# EAGLE schematic time-circuits (EAGLE 9.1.0)
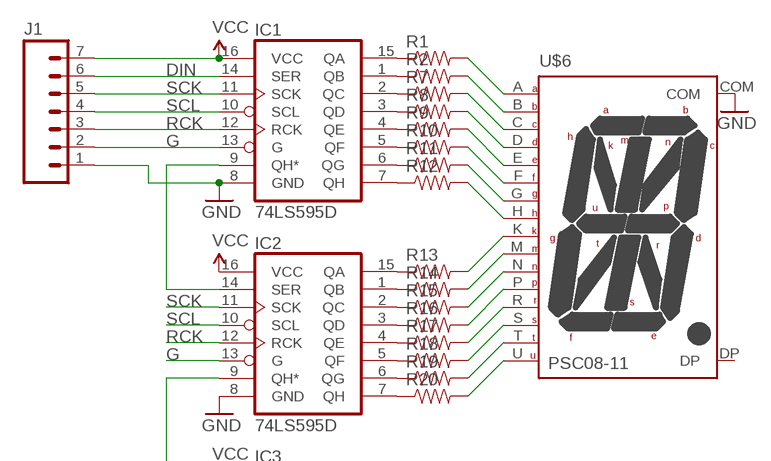
[diagram p0: schematic, sheet 1, part 1 of 2]
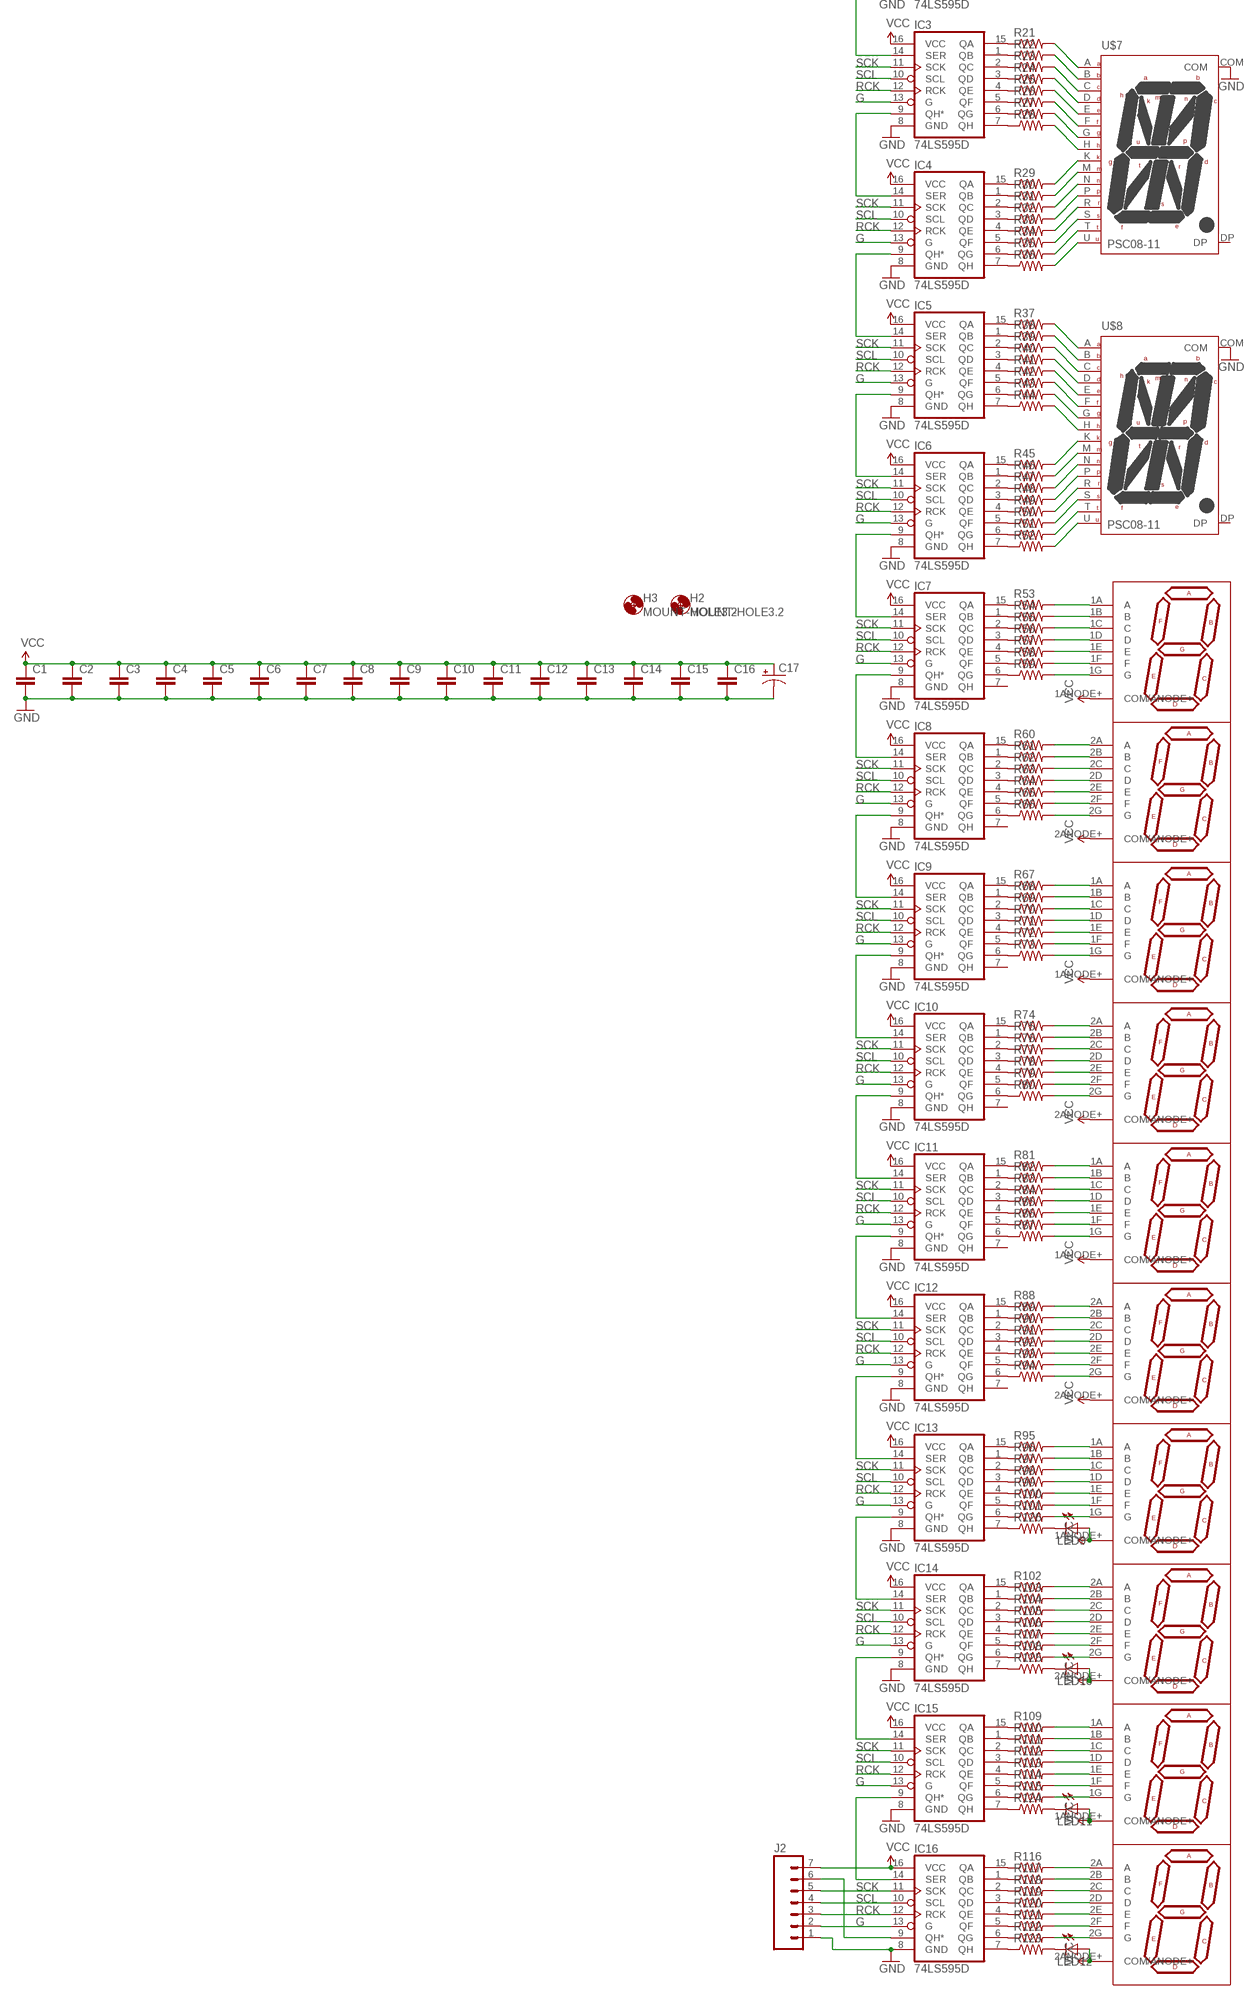
[diagram p1: schematic, sheet 1, part 2 of 2]

## Parts
C1  CAP0805  [0805]
C2  CAP0805  [0805]
C3  CAP0805  [0805]
C4  CAP0805  [0805]
C5  CAP0805  [0805]
C6  CAP0805  [0805]
C7  CAP0805  [0805]
C8  CAP0805  [0805]
C9  CAP0805  [0805]
C10  CAP0805  [0805]
C11  CAP0805  [0805]
C12  CAP0805  [0805]
C13  CAP0805  [0805]
C14  CAP0805  [0805]
C15  CAP0805  [0805]
C16  CAP0805  [0805]
C17  CAP_POLH13  [PANASONIC_H13]
H2  MOUNT-HOLE3.2  [3,2]
H3  MOUNT-HOLE3.2  [3,2]
IC1  74LS595D  [SO16]
IC2  74LS595D  [SO16]
IC3  74LS595D  [SO16]
IC4  74LS595D  [SO16]
IC5  74LS595D  [SO16]
IC6  74LS595D  [SO16]
IC7  74LS595D  [SO16]
IC8  74LS595D  [SO16]
IC9  74LS595D  [SO16]
IC10  74LS595D  [SO16]
IC11  74LS595D  [SO16]
IC12  74LS595D  [SO16]
IC13  74LS595D  [SO16]
IC14  74LS595D  [SO16]
IC15  74LS595D  [SO16]
IC16  74LS595D  [SO16]
J1  M07LOCK  [1X07_LOCK]
J2  M07LOCK  [1X07_LOCK]
LED9  LED5MM  [LED5MM]
LED10  LED5MM  [LED5MM]
LED11  LED5MM  [LED5MM]
LED12  LED5MM  [LED5MM]
R1  RESISTOR0805-RES  [0805]
R2  RESISTOR0805-RES  [0805]
R7  RESISTOR0805-RES  [0805]
R8  RESISTOR0805-RES  [0805]
R9  RESISTOR0805-RES  [0805]
R10  RESISTOR0805-RES  [0805]
R11  RESISTOR0805-RES  [0805]
R12  RESISTOR0805-RES  [0805]
R13  RESISTOR0805-RES  [0805]
R14  RESISTOR0805-RES  [0805]
R15  RESISTOR0805-RES  [0805]
R16  RESISTOR0805-RES  [0805]
R17  RESISTOR0805-RES  [0805]
R18  RESISTOR0805-RES  [0805]
R19  RESISTOR0805-RES  [0805]
R20  RESISTOR0805-RES  [0805]
R21  RESISTOR0805-RES  [0805]
R22  RESISTOR0805-RES  [0805]
R23  RESISTOR0805-RES  [0805]
R24  RESISTOR0805-RES  [0805]
R25  RESISTOR0805-RES  [0805]
R26  RESISTOR0805-RES  [0805]
R27  RESISTOR0805-RES  [0805]
R28  RESISTOR0805-RES  [0805]
R29  RESISTOR0805-RES  [0805]
R30  RESISTOR0805-RES  [0805]
R31  RESISTOR0805-RES  [0805]
R32  RESISTOR0805-RES  [0805]
R33  RESISTOR0805-RES  [0805]
R34  RESISTOR0805-RES  [0805]
R35  RESISTOR0805-RES  [0805]
R36  RESISTOR0805-RES  [0805]
R37  RESISTOR0805-RES  [0805]
R38  RESISTOR0805-RES  [0805]
R39  RESISTOR0805-RES  [0805]
R40  RESISTOR0805-RES  [0805]
R41  RESISTOR0805-RES  [0805]
R42  RESISTOR0805-RES  [0805]
R43  RESISTOR0805-RES  [0805]
R44  RESISTOR0805-RES  [0805]
R45  RESISTOR0805-RES  [0805]
R46  RESISTOR0805-RES  [0805]
R47  RESISTOR0805-RES  [0805]
R48  RESISTOR0805-RES  [0805]
R49  RESISTOR0805-RES  [0805]
R50  RESISTOR0805-RES  [0805]
R51  RESISTOR0805-RES  [0805]
R52  RESISTOR0805-RES  [0805]
R53  RESISTOR0805-RES  [0805]
R54  RESISTOR0805-RES  [0805]
R55  RESISTOR0805-RES  [0805]
R56  RESISTOR0805-RES  [0805]
R57  RESISTOR0805-RES  [0805]
R58  RESISTOR0805-RES  [0805]
R59  RESISTOR0805-RES  [0805]
R60  RESISTOR0805-RES  [0805]
R61  RESISTOR0805-RES  [0805]
R62  RESISTOR0805-RES  [0805]
R63  RESISTOR0805-RES  [0805]
R64  RESISTOR0805-RES  [0805]
R65  RESISTOR0805-RES  [0805]
R66  RESISTOR0805-RES  [0805]
R67  RESISTOR0805-RES  [0805]
R68  RESISTOR0805-RES  [0805]
R69  RESISTOR0805-RES  [0805]
R70  RESISTOR0805-RES  [0805]
R71  RESISTOR0805-RES  [0805]
R72  RESISTOR0805-RES  [0805]
R73  RESISTOR0805-RES  [0805]
R74  RESISTOR0805-RES  [0805]
R75  RESISTOR0805-RES  [0805]
R76  RESISTOR0805-RES  [0805]
R77  RESISTOR0805-RES  [0805]
R78  RESISTOR0805-RES  [0805]
R79  RESISTOR0805-RES  [0805]
R80  RESISTOR0805-RES  [0805]
R81  RESISTOR0805-RES  [0805]
R82  RESISTOR0805-RES  [0805]
R83  RESISTOR0805-RES  [0805]
R84  RESISTOR0805-RES  [0805]
R85  RESISTOR0805-RES  [0805]
R86  RESISTOR0805-RES  [0805]
R87  RESISTOR0805-RES  [0805]
R88  RESISTOR0805-RES  [0805]
R89  RESISTOR0805-RES  [0805]
R90  RESISTOR0805-RES  [0805]
R91  RESISTOR0805-RES  [0805]
R92  RESISTOR0805-RES  [0805]
R93  RESISTOR0805-RES  [0805]
R94  RESISTOR0805-RES  [0805]
R95  RESISTOR0805-RES  [0805]
R96  RESISTOR0805-RES  [0805]
R97  RESISTOR0805-RES  [0805]
R98  RESISTOR0805-RES  [0805]
R99  RESISTOR0805-RES  [0805]
R100  RESISTOR0805-RES  [0805]
R101  RESISTOR0805-RES  [0805]
R102  RESISTOR0805-RES  [0805]
R103  RESISTOR0805-RES  [0805]
R104  RESISTOR0805-RES  [0805]
R105  RESISTOR0805-RES  [0805]
R106  RESISTOR0805-RES  [0805]
R107  RESISTOR0805-RES  [0805]
R108  RESISTOR0805-RES  [0805]
R109  RESISTOR0805-RES  [0805]
R110  RESISTOR0805-RES  [0805]
R111  RESISTOR0805-RES  [0805]
R112  RESISTOR0805-RES  [0805]
R113  RESISTOR0805-RES  [0805]
R114  RESISTOR0805-RES  [0805]
R115  RESISTOR0805-RES  [0805]
R116  RESISTOR0805-RES  [0805]
R117  RESISTOR0805-RES  [0805]
R118  RESISTOR0805-RES  [0805]
R119  RESISTOR0805-RES  [0805]
R120  RESISTOR0805-RES  [0805]
R121  RESISTOR0805-RES  [0805]
R122  RESISTOR0805-RES  [0805]
R123  RESISTOR0805-RES  [0805]
R124  RESISTOR0805-RES  [0805]
R125  RESISTOR0805-RES  [0805]
R126  RESISTOR0805-RES  [0805]
U$1  DA08-11  [DA08-11]
U$2  DA08-11  [DA08-11]
U$3  DA08-11  [DA08-11]
U$4  DA08-11  [DA08-11]
U$5  DA08-11  [DA08-11]
U$6  PSC08-11  [PSC08-11]
U$7  PSC08-11  [PSC08-11]
U$8  PSC08-11  [PSC08-11]

## Nets
DIN: IC1.14(SER) J1.6
G: IC1.13(G) IC2.13(G) IC3.13(G) IC4.13(G) IC5.13(G) IC6.13(G) IC7.13(G) IC8.13(G) IC9.13(G) IC10.13(G) IC11.13(G) IC12.13(G) IC13.13(G) IC14.13(G) IC15.13(G) IC16.13(G) J1.2 J2.2
GND: C1.2 C2.2 C3.2 C4.2 C5.2 C6.2 C7.2 C8.2 C9.2 C10.2 C11.2 C12.2 C13.2 C14.2 C15.2 C16.2 C17.- IC1.8(GND) IC2.8(GND) IC3.8(GND) IC4.8(GND) IC5.8(GND) IC6.8(GND) IC7.8(GND) IC8.8(GND) IC9.8(GND) IC10.8(GND) IC11.8(GND) IC12.8(GND) IC13.8(GND) IC14.8(GND) IC15.8(GND) IC16.8(GND) J1.1 J2.1 U$6.COM U$7.COM U$8.COM
N$1: IC5.9(QH*) IC6.14(SER)
N$2: IC1.9(QH*) IC2.14(SER)
N$3: IC1.15(QA) R1.1
N$4: IC1.1(QB) R2.1
N$5: IC1.2(QC) R7.1
N$6: IC1.3(QD) R8.1
N$7: IC1.4(QE) R9.1
N$8: IC1.5(QF) R10.1
N$9: IC1.6(QG) R11.1
N$10: IC1.7(QH) R12.1
N$11: IC2.15(QA) R13.1
N$12: IC2.1(QB) R14.1
N$13: IC2.2(QC) R15.1
N$14: R53.2 U$1.1A(DIG1:A)
N$15: IC16.9(QH*) J2.6
N$16: R54.2 U$1.1B(DIG1:B)
N$17: R55.2 U$1.1C(DIG1:C)
N$18: IC2.3(QD) R16.1
N$19: IC2.4(QE) R17.1
N$20: R56.2 U$1.1D(DIG1:D)
N$21: R57.2 U$1.1E(DIG1:E)
N$22: R58.2 U$1.1F(DIG1:F)
N$23: R59.2 U$1.1G(DIG1:G)
N$24: R60.2 U$1.2A(DIG2:A)
N$25: R61.2 U$1.2B(DIG2:B)
N$26: R62.2 U$1.2C(DIG2:C)
N$27: IC2.5(QF) R18.1
N$28: IC2.6(QG) R19.1
N$29: IC2.7(QH) R20.1
N$30: R1.2 U$6.A
N$31: R2.2 U$6.B
N$32: R7.2 U$6.C
N$33: R8.2 U$6.D
N$34: R9.2 U$6.E
N$35: R10.2 U$6.F
N$36: R11.2 U$6.G
N$37: R12.2 U$6.H
N$38: R13.2 U$6.K
N$39: R14.2 U$6.M
N$40: R15.2 U$6.N
N$41: R16.2 U$6.P
N$42: R17.2 U$6.R
N$43: R18.2 U$6.S
N$44: R19.2 U$6.T
N$45: R20.2 U$6.U
N$46: IC3.9(QH*) IC4.14(SER)
N$47: IC3.15(QA) R21.1
N$48: IC3.1(QB) R22.1
N$49: IC3.2(QC) R23.1
N$50: IC3.3(QD) R24.1
N$51: IC3.4(QE) R25.1
N$52: IC3.5(QF) R26.1
N$53: IC3.6(QG) R27.1
N$54: IC3.7(QH) R28.1
N$55: IC4.15(QA) R29.1
N$56: IC4.1(QB) R30.1
N$57: IC4.2(QC) R31.1
N$58: IC4.3(QD) R32.1
N$59: IC4.4(QE) R33.1
N$60: IC4.5(QF) R34.1
N$61: IC4.6(QG) R35.1
N$62: IC4.7(QH) R36.1
N$63: R21.2 U$7.A
N$64: R22.2 U$7.B
N$65: R23.2 U$7.C
N$66: R24.2 U$7.D
N$67: R25.2 U$7.E
N$68: R26.2 U$7.F
N$69: R27.2 U$7.G
N$70: R28.2 U$7.H
N$71: R29.2 U$7.K
N$72: R30.2 U$7.M
N$73: R31.2 U$7.N
N$74: R32.2 U$7.P
N$75: R33.2 U$7.R
N$76: R34.2 U$7.S
N$77: R35.2 U$7.T
N$78: R36.2 U$7.U
N$79: IC5.15(QA) R37.1
N$80: IC5.1(QB) R38.1
N$81: IC5.2(QC) R39.1
N$82: IC5.3(QD) R40.1
N$83: IC5.4(QE) R41.1
N$84: IC5.5(QF) R42.1
N$85: IC5.6(QG) R43.1
N$86: IC5.7(QH) R44.1
N$87: IC6.15(QA) R45.1
N$88: IC6.1(QB) R46.1
N$89: IC6.2(QC) R47.1
N$90: IC6.3(QD) R48.1
N$91: IC6.4(QE) R49.1
N$92: IC6.5(QF) R50.1
N$93: IC6.6(QG) R51.1
N$94: IC6.7(QH) R52.1
N$95: R37.2 U$8.A
N$96: R38.2 U$8.B
N$97: R39.2 U$8.C
N$98: R40.2 U$8.D
N$99: R41.2 U$8.E
N$100: R42.2 U$8.F
N$101: R43.2 U$8.G
N$102: R44.2 U$8.H
N$103: R45.2 U$8.K
N$104: R46.2 U$8.M
N$105: R47.2 U$8.N
N$106: R48.2 U$8.P
N$107: R49.2 U$8.R
N$108: R50.2 U$8.S
N$109: R51.2 U$8.T
N$110: R52.2 U$8.U
N$111: IC2.9(QH*) IC3.14(SER)
N$112: IC4.9(QH*) IC5.14(SER)
N$113: IC6.9(QH*) IC7.14(SER)
N$114: IC7.15(QA) R53.1
N$115: IC7.1(QB) R54.1
N$116: IC7.2(QC) R55.1
N$117: IC7.3(QD) R56.1
N$118: IC7.4(QE) R57.1
N$119: IC7.5(QF) R58.1
N$120: IC7.6(QG) R59.1
N$121: IC7.9(QH*) IC8.14(SER)
N$122: IC8.15(QA) R60.1
N$123: IC8.1(QB) R61.1
N$124: IC8.2(QC) R62.1
N$125: IC8.3(QD) R63.1
N$126: IC8.4(QE) R64.1
N$127: IC8.5(QF) R65.1
N$128: IC8.6(QG) R66.1
N$129: R63.2 U$1.2D(DIG2:D)
N$130: R64.2 U$1.2E(DIG2:E)
N$131: R65.2 U$1.2F(DIG2:F)
N$132: R66.2 U$1.2G(DIG2:G)
N$133: R67.2 U$2.1A(DIG1:A)
N$134: R68.2 U$2.1B(DIG1:B)
N$135: R69.2 U$2.1C(DIG1:C)
N$136: R70.2 U$2.1D(DIG1:D)
N$137: R71.2 U$2.1E(DIG1:E)
N$138: R72.2 U$2.1F(DIG1:F)
N$139: R73.2 U$2.1G(DIG1:G)
N$140: R74.2 U$2.2A(DIG2:A)
N$141: R75.2 U$2.2B(DIG2:B)
N$142: R76.2 U$2.2C(DIG2:C)
N$143: IC8.9(QH*) IC9.14(SER)
N$144: IC9.15(QA) R67.1
N$145: IC9.1(QB) R68.1
N$146: IC9.2(QC) R69.1
N$147: IC9.3(QD) R70.1
N$148: IC9.4(QE) R71.1
N$149: IC9.5(QF) R72.1
N$150: IC9.6(QG) R73.1
N$151: R77.2 U$2.2D(DIG2:D)
N$152: R78.2 U$2.2E(DIG2:E)
N$153: R79.2 U$2.2F(DIG2:F)
N$154: R80.2 U$2.2G(DIG2:G)
N$155: R81.2 U$3.1A(DIG1:A)
N$156: R82.2 U$3.1B(DIG1:B)
N$157: R83.2 U$3.1C(DIG1:C)
N$158: IC9.9(QH*) IC10.14(SER)
N$159: IC10.15(QA) R74.1
N$160: IC10.1(QB) R75.1
N$161: IC10.2(QC) R76.1
N$162: IC10.3(QD) R77.1
N$163: IC10.4(QE) R78.1
N$164: IC10.5(QF) R79.1
N$165: IC10.6(QG) R80.1
N$166: R84.2 U$3.1D(DIG1:D)
N$167: R85.2 U$3.1E(DIG1:E)
N$168: R86.2 U$3.1F(DIG1:F)
N$169: R87.2 U$3.1G(DIG1:G)
N$170: R88.2 U$3.2A(DIG2:A)
N$171: R89.2 U$3.2B(DIG2:B)
N$172: R90.2 U$3.2C(DIG2:C)
N$173: IC10.9(QH*) IC11.14(SER)
N$174: IC11.15(QA) R81.1
N$175: IC11.1(QB) R82.1
N$176: IC11.2(QC) R83.1
N$177: IC11.3(QD) R84.1
N$178: IC11.4(QE) R85.1
N$179: IC11.5(QF) R86.1
N$180: IC11.6(QG) R87.1
N$181: R91.2 U$3.2D(DIG2:D)
N$182: R92.2 U$3.2E(DIG2:E)
N$183: R93.2 U$3.2F(DIG2:F)
N$184: R94.2 U$3.2G(DIG2:G)
N$185: R95.2 U$4.1A(DIG1:A)
N$186: R96.2 U$4.1B(DIG1:B)
N$187: R97.2 U$4.1C(DIG1:C)
N$188: IC11.9(QH*) IC12.14(SER)
N$189: IC12.15(QA) R88.1
N$190: IC12.1(QB) R89.1
N$191: IC12.2(QC) R90.1
N$192: IC12.3(QD) R91.1
N$193: IC12.4(QE) R92.1
N$194: IC12.5(QF) R93.1
N$195: IC12.6(QG) R94.1
N$196: R98.2 U$4.1D(DIG1:D)
N$197: R99.2 U$4.1E(DIG1:E)
N$198: R100.2 U$4.1F(DIG1:F)
N$199: R101.2 U$4.1G(DIG1:G)
N$200: R102.2 U$4.2A(DIG2:A)
N$201: R103.2 U$4.2B(DIG2:B)
N$202: R104.2 U$4.2C(DIG2:C)
N$203: IC12.9(QH*) IC13.14(SER)
N$204: IC13.15(QA) R95.1
N$205: IC13.1(QB) R96.1
N$206: IC13.2(QC) R97.1
N$207: IC13.3(QD) R98.1
N$208: IC13.4(QE) R99.1
N$209: IC13.5(QF) R100.1
N$210: IC13.6(QG) R101.1
N$211: IC13.9(QH*) IC14.14(SER)
N$212: IC14.15(QA) R102.1
N$213: IC14.1(QB) R103.1
N$214: IC14.2(QC) R104.1
N$215: IC14.3(QD) R105.1
N$216: IC14.4(QE) R106.1
N$217: IC14.5(QF) R107.1
N$218: IC14.6(QG) R108.1
N$219: IC14.9(QH*) IC15.14(SER)
N$220: IC15.15(QA) R109.1
N$221: IC15.1(QB) R110.1
N$222: IC15.2(QC) R111.1
N$223: IC15.3(QD) R112.1
N$224: IC15.4(QE) R113.1
N$225: IC15.5(QF) R114.1
N$226: IC15.6(QG) R115.1
N$227: IC15.9(QH*) IC16.14(SER)
N$228: IC16.15(QA) R116.1
N$229: IC16.1(QB) R117.1
N$230: IC16.2(QC) R118.1
N$231: IC16.3(QD) R119.1
N$232: IC16.4(QE) R120.1
N$233: IC16.5(QF) R121.1
N$234: IC16.6(QG) R122.1
N$235: R105.2 U$4.2D(DIG2:D)
N$236: R106.2 U$4.2E(DIG2:E)
N$237: R107.2 U$4.2F(DIG2:F)
N$238: R108.2 U$4.2G(DIG2:G)
N$239: R109.2 U$5.1A(DIG1:A)
N$240: R110.2 U$5.1B(DIG1:B)
N$241: R111.2 U$5.1C(DIG1:C)
N$242: R112.2 U$5.1D(DIG1:D)
N$243: R113.2 U$5.1E(DIG1:E)
N$244: R114.2 U$5.1F(DIG1:F)
N$245: R115.2 U$5.1G(DIG1:G)
N$246: R116.2 U$5.2A(DIG2:A)
N$247: R117.2 U$5.2B(DIG2:B)
N$248: R118.2 U$5.2C(DIG2:C)
N$249: R119.2 U$5.2D(DIG2:D)
N$250: R120.2 U$5.2E(DIG2:E)
N$251: R121.2 U$5.2F(DIG2:F)
N$252: R122.2 U$5.2G(DIG2:G)
N$263: IC16.7(QH) R123.1
N$264: IC15.7(QH) R124.1
N$265: IC14.7(QH) R125.1
N$266: IC13.7(QH) R126.1
N$267: LED9.K(C) R126.2
N$268: LED10.K(C) R125.2
N$269: LED11.K(C) R124.2
N$270: LED12.K(C) R123.2
RCK: IC1.12(RCK) IC2.12(RCK) IC3.12(RCK) IC4.12(RCK) IC5.12(RCK) IC6.12(RCK) IC7.12(RCK) IC8.12(RCK) IC9.12(RCK) IC10.12(RCK) IC11.12(RCK) IC12.12(RCK) IC13.12(RCK) IC14.12(RCK) IC15.12(RCK) IC16.12(RCK) J1.3 J2.3
SCK: IC1.11(SCK) IC2.11(SCK) IC3.11(SCK) IC4.11(SCK) IC5.11(SCK) IC6.11(SCK) IC7.11(SCK) IC8.11(SCK) IC9.11(SCK) IC10.11(SCK) IC11.11(SCK) IC12.11(SCK) IC13.11(SCK) IC14.11(SCK) IC15.11(SCK) IC16.11(SCK) J1.5 J2.5
SCL: IC1.10(SCL) IC2.10(SCL) IC3.10(SCL) IC4.10(SCL) IC5.10(SCL) IC6.10(SCL) IC7.10(SCL) IC8.10(SCL) IC9.10(SCL) IC10.10(SCL) IC11.10(SCL) IC12.10(SCL) IC13.10(SCL) IC14.10(SCL) IC15.10(SCL) IC16.10(SCL) J1.4 J2.4
VCC [power]: C1.1 C2.1 C3.1 C4.1 C5.1 C6.1 C7.1 C8.1 C9.1 C10.1 C11.1 C12.1 C13.1 C14.1 C15.1 C16.1 C17.+ IC1.16(VCC) IC2.16(VCC) IC3.16(VCC) IC4.16(VCC) IC5.16(VCC) IC6.16(VCC) IC7.16(VCC) IC8.16(VCC) IC9.16(VCC) IC10.16(VCC) IC11.16(VCC) IC12.16(VCC) IC13.16(VCC) IC14.16(VCC) IC15.16(VCC) IC16.16(VCC) J1.7 J2.7 LED9.A LED10.A LED11.A LED12.A U$1.1ANODE+(DIG1:COM/ANODE+) U$1.2ANODE+(DIG2:COM/ANODE+) U$2.1ANODE+(DIG1:COM/ANODE+) U$2.2ANODE+(DIG2:COM/ANODE+) U$3.1ANODE+(DIG1:COM/ANODE+) U$3.2ANODE+(DIG2:COM/ANODE+) U$4.1ANODE+(DIG1:COM/ANODE+) U$4.2ANODE+(DIG2:COM/ANODE+) U$5.1ANODE+(DIG1:COM/ANODE+) U$5.2ANODE+(DIG2:COM/ANODE+)
Unconnected: IC7.7(QH) IC8.7(QH) IC9.7(QH) IC10.7(QH) IC11.7(QH) IC12.7(QH) U$6.DP U$7.DP U$8.DP

## Library data of the parts
C1-C16 = SparkFun-Passives:CAP: Capacitor Standard 0603 ceramic capacitor, and 0.1" leaded capacitor.
C17 = SparkFun-Passives:CAP_POL: Capacitor Polarized These are standard SMD and PTH capacitors. Normally 10uF, 47uF, and 100uF in electrolytic and tantalum varieties. Always verify the external diameter of the through hole cap, it varies with capacity, voltage, and manufacturer. The EIA devices should be standard.
H2 H3 = holes:MOUNT-HOLE: MOUNTING HOLE with drill center marker
IC1-IC16 = SparkFun-DigitalIC:74*595: 8-bit SHIFT REGISTER, output latch; PROD_ID: IC-07875
J1 J2 = SparkFun-Connectors:M07: Header 7 Standard 7-pin 0.1" header. Use with straight break away headers (SKU : PRT-00116), right angle break away headers (PRT-00553), swiss pins (PRT-00743), machine pins (PRT-00117), and female headers (PRT-00115). NOTES ON THE VARIANTS LOCK and LOCK_LONGPADS... This footprint was designed to help hold the alignment of a through-hole component (i.e. 7-pin header) while soldering it into place. You may notice that each hole has been shifted either up or down by 0.005 of an inch from it's more standard position (which is usually a perfectly straight line). This slight alteration caused the pins (the squares in the middle) to touch the edges of the holes. Because they are alternating, it causes a "brace" to hold the header in place. 0.005 has proven to be the perfect amount of "off-center" position when using our standard breakaway headers. Although looks a little odd when you look at the bare footprint, once you have a header in there, the alteration is very hard to notice. Also, if you push a header all the way into place, it is covered up entirely on the bottom side. This idea of altering the position of holes to aid alignment will be further integrated into the Sparkfun Library for other footprints. It can help hold any component with 3 or more connection pins.
LED9-LED12 = adafruit:LED: LED OSRAM: - CHIPLED LG R971, LG N971, LY N971, LG Q971, LY Q971, LO R971, LY R971 LH N974, LH R974 LS Q976, LO Q976, LY Q976 LO Q996 - Hyper CHIPLED LW Q18S LB Q993, LB Q99A, LB R99A - SideLED LS A670, LO A670, LY A670, LG A670, LP A670 LB A673, LV A673, LT A673, LW A673 LH A674 LY A675 LS A676, LA A676, LO A676, LY A676, LW A676 LS A679, LY A679, LG A679 - Hyper Micro SIDELED® LS Y876, LA Y876, LO Y876, LY Y876 LT Y87S - SmartLED LW L88C, LW L88S LB L89C, LB L89S, LG L890 LS L89K, LO L89K, LY L89K LS L896, LA L896, LO L896, LY L896 - TOPLED LS T670, LO T670, LY T670, LG T670, LP T670 LSG T670, LSP T670, LSY T670, LOP T670, LYG T670 LG T671, LOG T671, LSG T671 LB T673, LV T673, LT T673, LW T673 LH T674 LS T676, LA T676, LO T676, LY T676, LB T676, LH T676, LSB T676, LW T676 LB T67C, LV T67C, LT T67C, LS T67K, LO T67K, LY T67K, LW E67C LS E67B, LA E67B, LO E67B, LY E67B, LB E67C, LV E67C, LT E67C LW T67C LS T679, LY T679, LG T679 LS T770, LO T770, LY T770, LG T770, LP T770 LB T773, LV T773, LT T773, LW T773 LH T774 LS E675, LA E675, LY E675, LS T675 LS T776, LA T776, LO T776, LY T776, LB T776 LHGB T686 LT T68C, LB T68C - Hyper Mini TOPLED® LB M676 - Mini TOPLED Santana® LG M470 LS M47K, LO M47K, LY M47K Source: http://www.osram.convergy.de/
R1 R2 R7-R126 = SparkFun-Resistors:RESISTOR: Resistor Basic schematic elements and footprints for 0603, 1206, and PTH resistors.
U$1-U$5 = sonik:DA08-11
U$6-U$8 = sonik:PSC08-11

## Net classes
1 power: width 0.254 mm, clearance 0.203 mm